# Altium schematic sheet Sheet2.SchDoc
size A
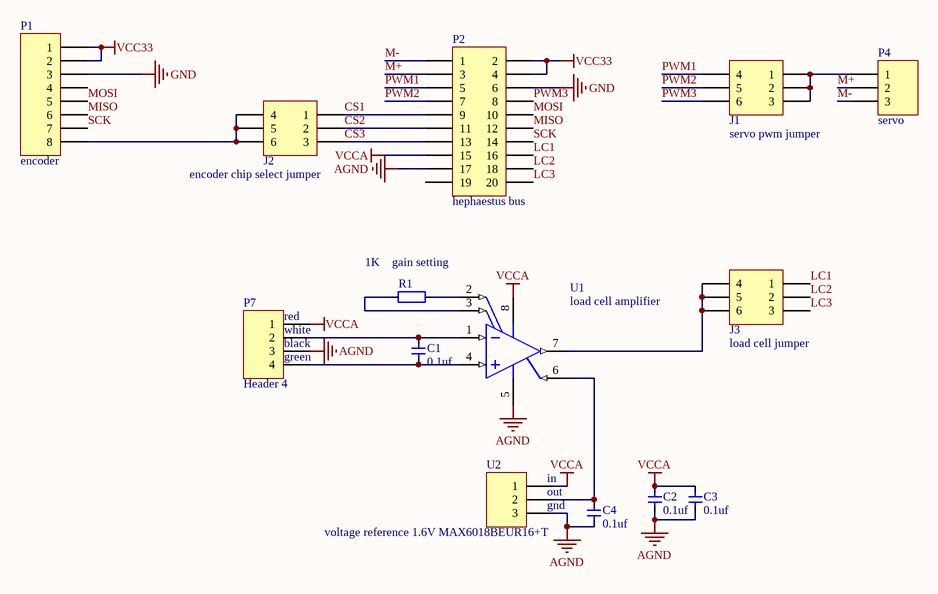
[diagram p0: Sheet2.SchDoc]

## Parts
C1  value 0.1uf  [CAP_0805]  (hidden comment: Cap_0805)
C2  value 0.1uf  [CAP_0805]  (hidden comment: Cap_0805)
C3  value 0.1uf  [CAP_0805]  (hidden comment: Cap_0805)
C4  value 0.1uf  [CAP_0805]  (hidden comment: Cap_0805)
J1  servo pwm jumper  [61300621121]
J2  encoder chip select jumper  [61300621121]
J3  load cell jumper  [61300621121]
P1  encoder  [HDR1X8]
P2  hephaestus bus  [612020235121]
P4  servo  [HDR1X3]
P7  Header 4  [HDR1X4]
R1  gain setting  value 1K  [RES_0805]
U1  load cell amplifier  [TI-D8_N]
U2  voltage reference 1.6V MAX6018BEUR16+T  [SOT23-3]

## Nets
AGND: C2.2 C3.2 C4.2 P2.17 P7.3 U1.5(VS-) U2.3
GND: P1.3 P2.6
VCC33: P1.1 P1.2 P2.2 P2.4
VCCA: C2.1 C3.1 P2.15 P7.1 U1.8(VS+) U2.1
CS1: J2.1 P2.9
CS2: J2.2 P2.11
CS3: J2.3 P2.13
LC1: J3.1 P2.16
LC2: J3.2 P2.18
LC3: J3.3 P2.20
M+: P2.3 P4.2
M-: P2.1 P4.3
MISO: P1.6 P2.12
MOSI: P1.5 P2.10
PWM1: J1.4 P2.5
PWM2: J1.5 P2.7
PWM3: J1.6 P2.8
SCK: P1.7 P2.14
NetC1_1: C1.1 P7.2 U1.1(IN-)
NetC1_2: C1.2 P7.4 U1.4(IN+)
NetC4_1: C4.1 U1.6(REF) U2.2
NetJ1_1: J1.1 J1.2 J1.3 P4.1
NetJ2_4: J2.4 J2.5 J2.6 P1.8
NetJ3_4: J3.4 J3.5 J3.6 U1.7(VOUT)
NetR1_1: R1.1 U1.2(RG)
NetR1_2: R1.2 U1.3(RG)

Not connected (* = marked no-connect by the designer): P1 4; P2 19

## Notes on the sheet
- (near P7) red
- (near P7) green
- (near P7) black
- (near P7) white
- (near U2) in
- (near U2) out
- (near U2) gnd

## Library data of the parts
C1-C4 = Cap_0805: Capacitor
J1-J3 = 61300621121: WR-PHD 2.54 mm THT Dual Pin Header, 06p; PublishedDate: July 2016; Publisher: Wurth Elektronik; ComponentLink1Description: Manufacturer; ComponentLink1URL: http://www.we-online.de; ComponentLink2Description: Datasheet; ComponentLink2URL: http://katalog.we-online.de/em/datasheet/6130xx21121.pdf; PartNumber: 61300621121; PinNumber: 06p
P1 = Header 8: Header, 8-Pin; LatestRevisionDate: 17-Jul-2002; LatestRevisionNote: Re-released for DXP Platform.; Publisher: Altium Limited
P2 = 612020235121: WR-BHD 2.54mm Male Box Header High Temperature; Manufacturer: Wurth Elektronik; ComponentLink1 Description: Manufacturer; ComponentLink2 Description: Datasheet; NoPins: 20; Created Date: March 2016; partNo: 612020235121; ComponentLink1URL: http://www.we-online.com; ComponentLink2URL: http://katalog.we-online.de/em/datasheet/6120xx235121.pdf; Created by: Baojun Chen
P4 = Header 3: Header, 3-Pin; LatestRevisionDate: 17-Jul-2002; LatestRevisionNote: Re-released for DXP Platform.; Publisher: Altium Limited
P7 = Header 4: Header, 4-Pin; LatestRevisionDate: 17-Jul-2002; LatestRevisionNote: Re-released for DXP Platform.; Publisher: Altium Limited
R1 = Res_0805: Resistor
U1 = INA826AIDR: Precision, 200-uA Supply Current, 36-V Supply Instrumentation Amplifier, -40 to 125 degC, 8-pin SOIC (D8), Green (RoHS & no Sb/Br); Manufacturer: Texas Instruments; CMRR(Min)(dB): 84; Gain(V/V): 1 to 1000; Input Bias Current (+/-)(Max)(nA): 65; Input Offset (+/-)(Max)(uV): 150; Input Offset Drift (+/-)(Max)(uV/Degrees Celsius): 2; Noise at 1kHz(Typ)(nV/rt(Hz)): 18; Non-Linearity (+/-)(Max)(%): 0.0005; Number of Channels: 1; Output Offset (+/-)(Max)(uV): 700; Output Offset Drift (+/-)(Max)(uV/Degrees Celsius): 10; Quiescent Current (+/-)(Typ)(mA): 0.2; SubFamily: Single Supply; Vs(Max)(V): 36; Vs(Min)(V): 2.7; DatasheetVersion: SBOS562E; PackageVersion: 4040047-3/M, 06/2011; PackageReference: D8; PackageDescription: 8-Pin Plastic Small Outline, Body 4.9 x 3.9 mm, Pitch 1.27 mm; Supplier 1: Digi-Key; Supplier Part Number 1: 296-30238-2-ND; Supplier 2: Digi-Key; Supplier Part Number 2: 296-30238-1-ND; Supplier 3: Digi-Key; Supplier Part Number 3: 296-30238-6-ND; Supplier 4: Newark; Supplier Part Number 4: 82T3832; Supplier 5: Mouser; Supplier Part Number 5: 595-INA826AIDR; Eco-Plan: Green (RoHS & no Sb/Br); Mounting Technology: Surface Mount; Code_JEDEC: MS-012; PartNumber: INA826AIDR; ComponentLink1Description: Manufacturer URL; ComponentLink1URL: http://www.ti.com/; ComponentLink2Description: Datasheet; ComponentLink2URL: http://www.ti.com/general/docs/lit/getliterature.tsp?genericPartNumber=INA826&fileType=pdf; ComponentLink3Description: Package Specification; ComponentLink3URL: http://www.ti.com/litv/pdf/msoi002j
U2 = Header 3: MAX6018BEUR16+T; LatestRevisionDate: 17-Jul-2002; LatestRevisionNote: Re-released for DXP Platform.; Publisher: Altium Limited